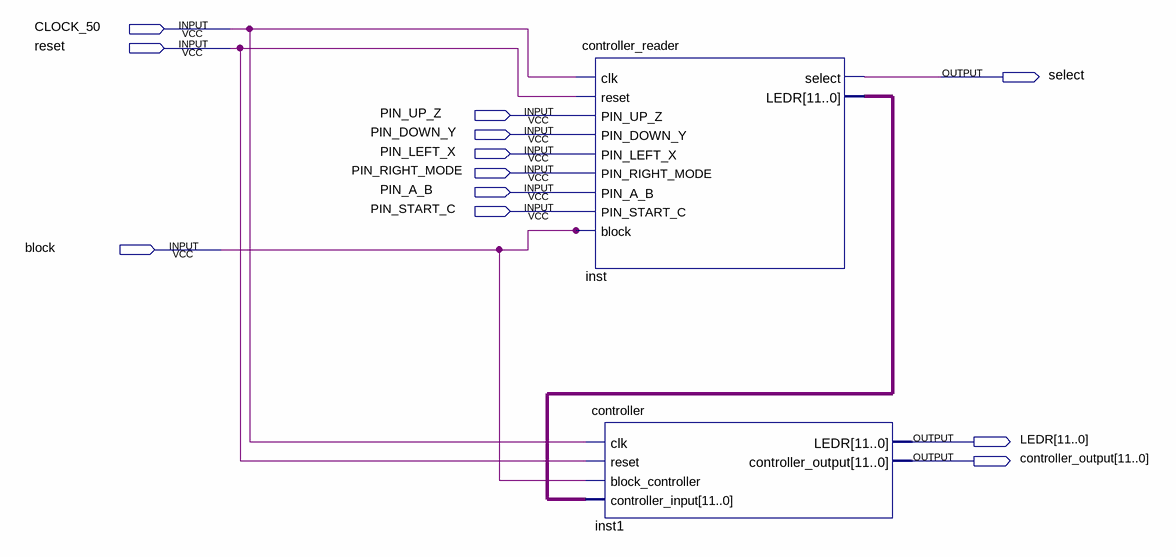
[diagram p0: schematic sheet]
// Quartus schematic top.bdf as structural Verilog: 2 symbols, 12 pins
module top (
  input  CLOCK_50,
  input  reset,
  input  PIN_UP_Z,
  input  PIN_DOWN_Y,
  input  PIN_LEFT_X,
  input  PIN_RIGHT_MODE,
  input  PIN_A_B,
  input  PIN_START_C,
  input  block,
  output select,
  output [11:0] LEDR,
  output [11:0] controller_output
);

  wire [11:0] inst_ledr;

  controller_reader inst (
    .clk(CLOCK_50), .reset(reset), .PIN_UP_Z(PIN_UP_Z), .PIN_DOWN_Y(PIN_DOWN_Y), .PIN_LEFT_X(PIN_LEFT_X),
    .PIN_RIGHT_MODE(PIN_RIGHT_MODE), .PIN_A_B(PIN_A_B), .PIN_START_C(PIN_START_C), .block(block),
    .select(select), .LEDR(inst_ledr));
  controller inst1 (
    .clk(CLOCK_50), .reset(reset), .block_controller(block), .controller_input(inst_ledr), .LEDR(LEDR),
    .controller_output(controller_output));
endmodule
